# EAGLE design multiEncoder (EAGLE 9.6.2)
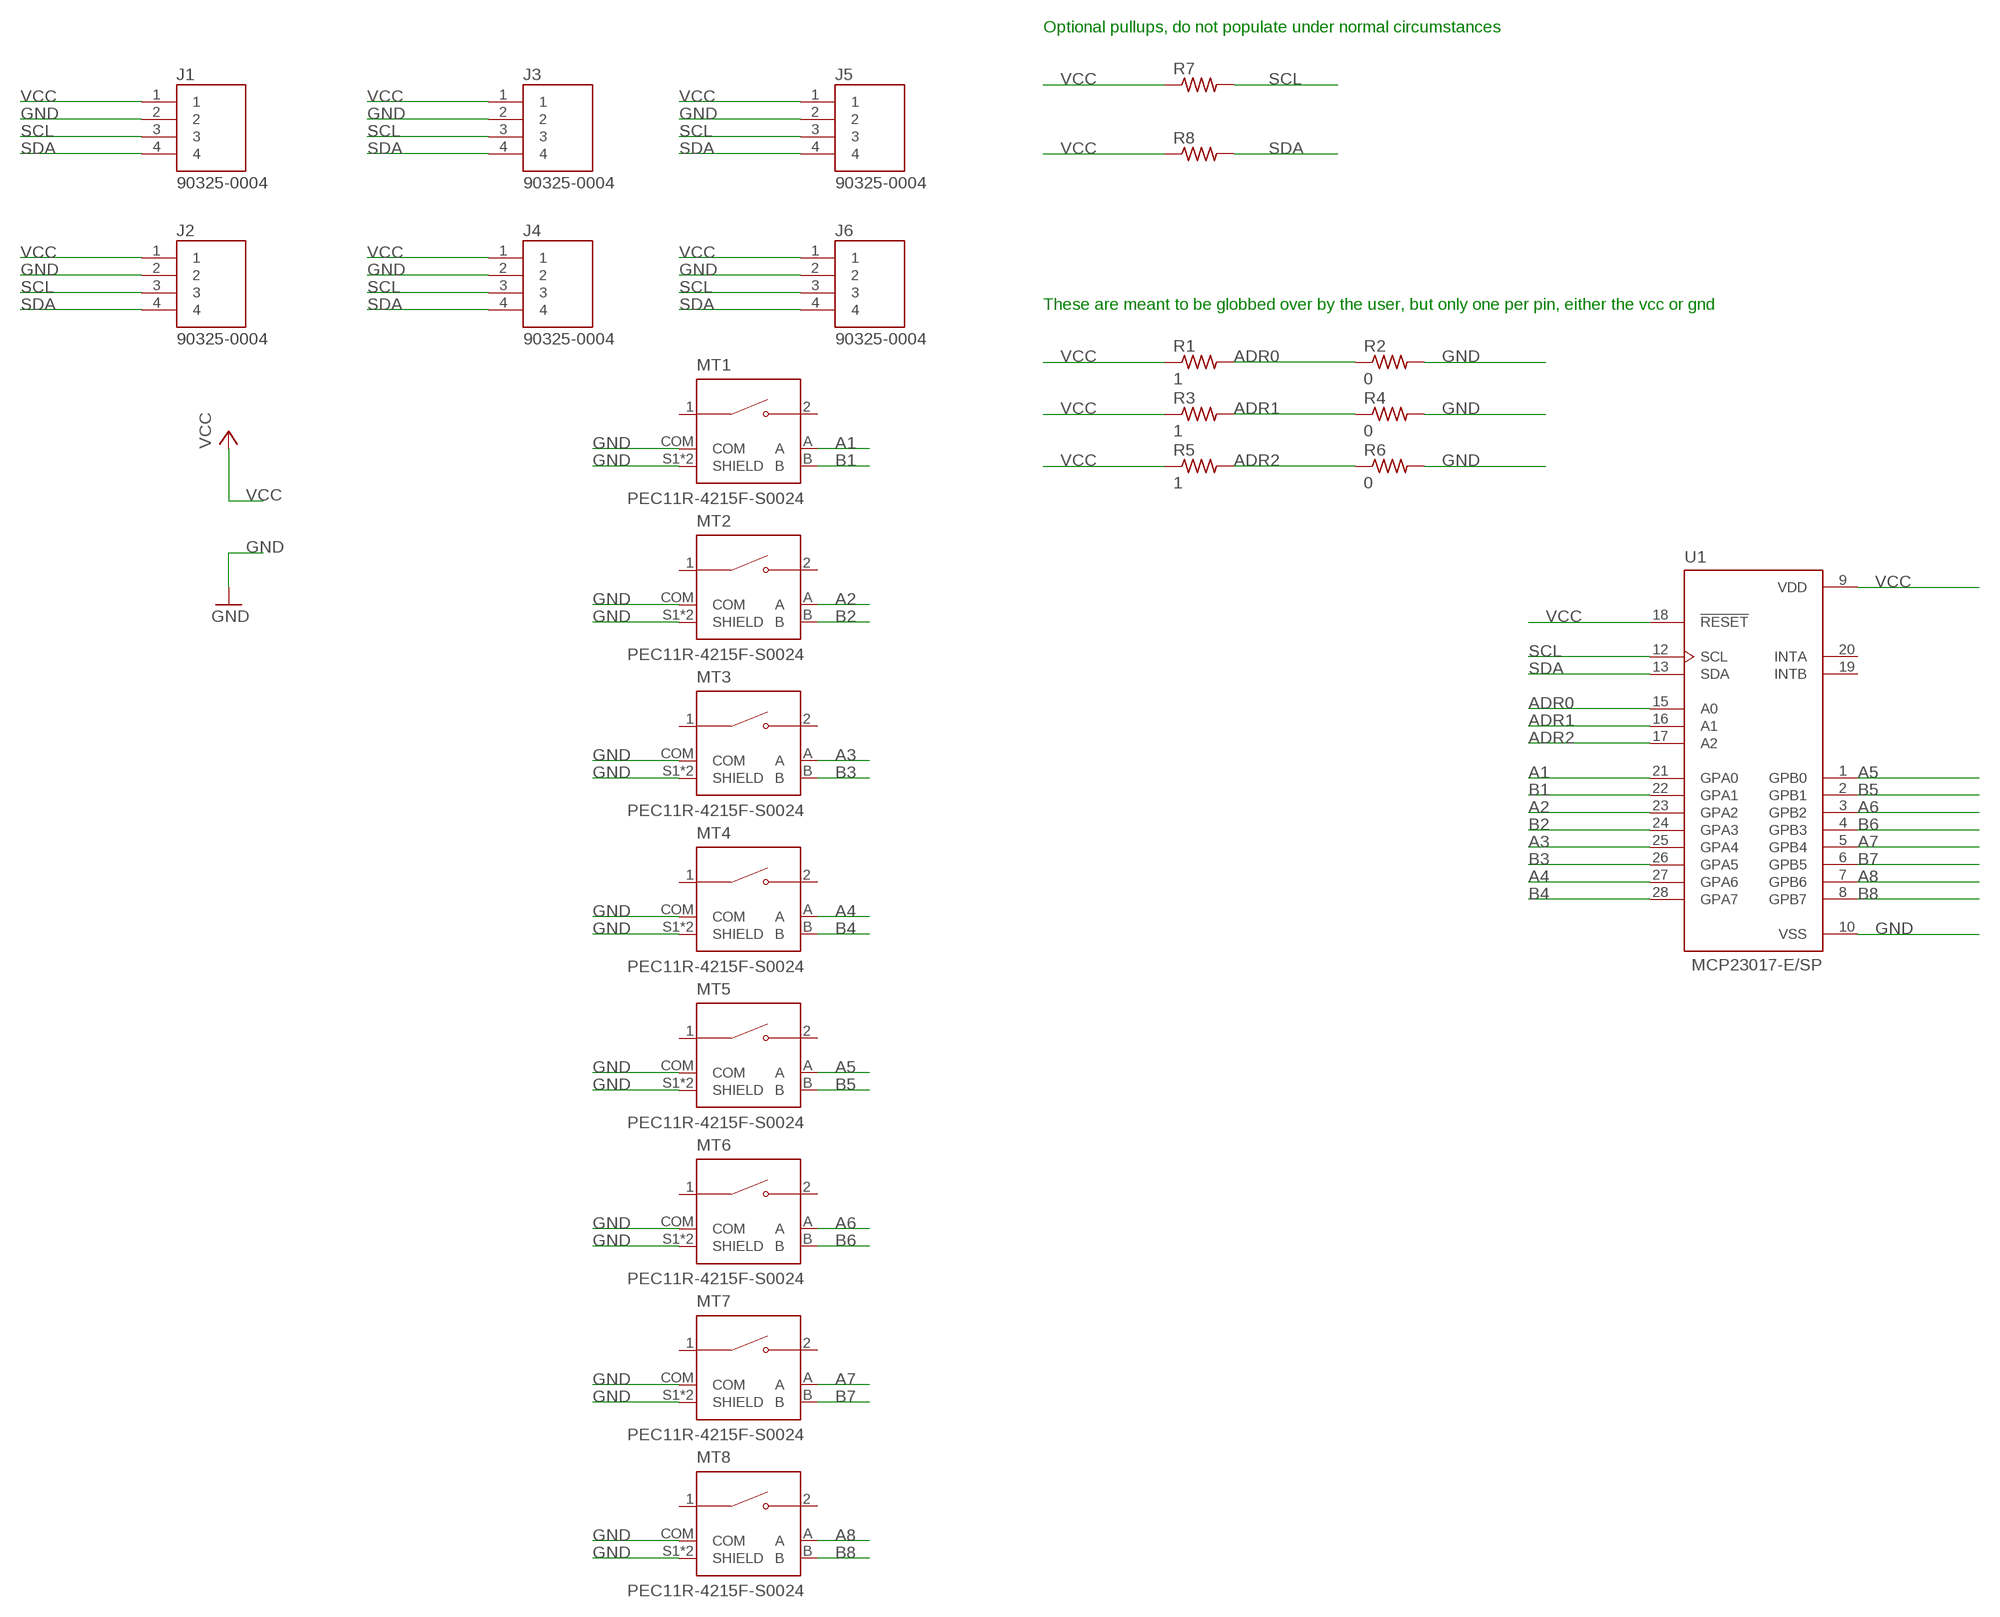
[diagram p0: schematic, sheet 1]

## Parts
J1  90325-0004  [MOLEX_90325-0004]
J2  90325-0004  [MOLEX_90325-0004]
J3  90325-0004  [MOLEX_90325-0004]
J4  90325-0004  [MOLEX_90325-0004]
J5  90325-0004  [MOLEX_90325-0004]
J6  90325-0004  [MOLEX_90325-0004]
MT1  PEC11R-4215F-S0024  [XDCR_PEC11R-4215F-S0024]
MT2  PEC11R-4215F-S0024  [XDCR_PEC11R-4215F-S0024]
MT3  PEC11R-4215F-S0024  [XDCR_PEC11R-4215F-S0024]
MT4  PEC11R-4215F-S0024  [XDCR_PEC11R-4215F-S0024]
MT5  PEC11R-4215F-S0024  [XDCR_PEC11R-4215F-S0024]
MT6  PEC11R-4215F-S0024  [XDCR_PEC11R-4215F-S0024]
MT7  PEC11R-4215F-S0024  [XDCR_PEC11R-4215F-S0024]
MT8  PEC11R-4215F-S0024  [XDCR_PEC11R-4215F-S0024]
R1  1  R-US_R0805  [R0805]
R2  0  R-US_R0805  [R0805]
R3  1  R-US_R0805  [R0805]
R4  0  R-US_R0805  [R0805]
R5  1  R-US_R0805  [R0805]
R6  0  R-US_R0805  [R0805]
R7  1K  R-US_R0805  [R0805]
R8  1K  R-US_R0805  [R0805]
U1  MCP23017-E/SP  [DIP787W45P254L3556H508Q28]

## Nets
A1: MT1.A U1.21(GPA0)
A2: MT2.A U1.23(GPA2)
A3: MT3.A U1.25(GPA4)
A4: MT4.A U1.27(GPA6)
A5: MT5.A U1.1(GPB0)
A6: MT6.A U1.3(GPB2)
A7: MT7.A U1.5(GPB4)
A8: MT8.A U1.7(GPB6)
ADR0: R1.2 R2.1 U1.15(A0)
ADR1: R3.2 R4.1 U1.16(A1)
ADR2: R5.2 R6.1 U1.17(A2)
B1: MT1.B U1.22(GPA1)
B2: MT2.B U1.24(GPA3)
B3: MT3.B U1.26(GPA5)
B4: MT4.B U1.28(GPA7)
B5: MT5.B U1.2(GPB1)
B6: MT6.B U1.4(GPB3)
B7: MT7.B U1.6(GPB5)
B8: MT8.B U1.8(GPB7)
GND: J1.2 J2.2 J3.2 J4.2 J5.2 J6.2 MT1.COM MT1.S1(SHIELD) MT1.S2(SHIELD) MT2.COM MT2.S1(SHIELD) MT2.S2(SHIELD) MT3.COM MT3.S1(SHIELD) MT3.S2(SHIELD) MT4.COM MT4.S1(SHIELD) MT4.S2(SHIELD) MT5.COM MT5.S1(SHIELD) MT5.S2(SHIELD) MT6.COM MT6.S1(SHIELD) MT6.S2(SHIELD) MT7.COM MT7.S1(SHIELD) MT7.S2(SHIELD) MT8.COM MT8.S1(SHIELD) MT8.S2(SHIELD) R2.2 R4.2 R6.2 U1.10(VSS)
SCL: J1.3 J2.3 J3.3 J4.3 J5.3 J6.3 R7.2 U1.12(SCL)
SDA: J1.4 J2.4 J3.4 J4.4 J5.4 J6.4 R8.2 U1.13(SDA)
VCC: J1.1 J2.1 J3.1 J4.1 J5.1 J6.1 R1.1 R3.1 R5.1 R7.1 R8.1 U1.9(VDD) U1.18(!RESET)
Unconnected: MT1.1 MT1.2 MT2.1 MT2.2 MT3.1 MT3.2 MT4.1 MT4.2 MT5.1 MT5.2 MT6.1 MT6.2 MT7.1 MT7.2 MT8.1 MT8.2 U1.19(INTB) U1.20(INTA)

## Notes on the sheet
- Optional pullups, do not populate under normal circumstances
- These are meant to be globbed over by the user, but only one per pin, either the vcc or gnd

## Library data of the parts
J1-J6 = 90325-0004:90325-0004: Connector Header Through Hole 4 position 0.050" (1.27mm) Check prices <https://pricing.snapeda.com/parts/90325-0004/Molex/view-part?ref=eda>; AVAILABILITY: In Stock; DESCRIPTION: HEADER, PICOFLEX, 4WAY; Connector Type:Wire-to-Board; Gender:Pin; Ways, No. of:4; Lead Spacing:1.27mm; Termination Method:Solder; Contact Material:Brass; Series:PICOFLEX PF50; Contact Plating:Tin; Rows, No. of:1; Colour:Black; Current Rating:1.2A; Flammability Rating:UL94V-0; Material:Polyester; No. of Poles:4; Pitch:1.27mm; Resistance, Contact:10mohm; Temp, Op. Max:105°C; Temp, Op. Min:-25°C; Voltage Rating, AC:250V; Voltage, Withstand:750V; Voltage, Working:250V; Width, External:3.81mm; Wire Size, AWG Max:26AWG; Wire Size, AWG Min:28AWG; Fixing Centres:7.41mm; MF: Molex; MP: 90325-0004; PACKAGE: None; PRICE: None; PURCHASE-URL: https://pricing.snapeda.com/search/part/90325-0004/?ref=eda
MT1-MT8 = PEC11R-4215F-S0024:PEC11R-4215F-S0024: Incremental Encoder, 12 Mm, Contact Rating 10 Ma - 5 Vdc Check prices <https://pricing.snapeda.com/parts/PEC11R-4215F-S0024/Bourns/view-part?ref=eda>; AVAILABILITY: In Stock; DESCRIPTION: Rotary Encoder Mechanical 24 Quadrature (Incremental) Vertical; MF: Bourns; MP: PEC11R-4215F-S0024; PACKAGE: None; PRICE: None; PURCHASE-URL: https://pricing.snapeda.com/search/part/PEC11R-4215F-S0024/?ref=eda
R1-R8 = rcl:R-US_: RESISTOR, American symbol; SPICEPREFIX: R
U1 = MCP23017-E_SP:MCP23017-E/SP: MCP23017 Series 5.5 V 1.7 MHz SMT 16-Bit I2C I/O Expander - SPDIP-28 Check prices <https://pricing.snapeda.com/parts/MCP23017-E/SP/Microchip/view-part?ref=eda>; AVAILABILITY: In Stock; DESCRIPTION: I/O Expander 16 I²C 1.7MHz 28-SPDIP; MF: Microchip; MP: MCP23017-E/SP; PACKAGE: DIP-28 Microchip; PRICE: None; PURCHASE-URL: https://pricing.snapeda.com/search/part/MCP23017-E/SP/?ref=eda

## Board
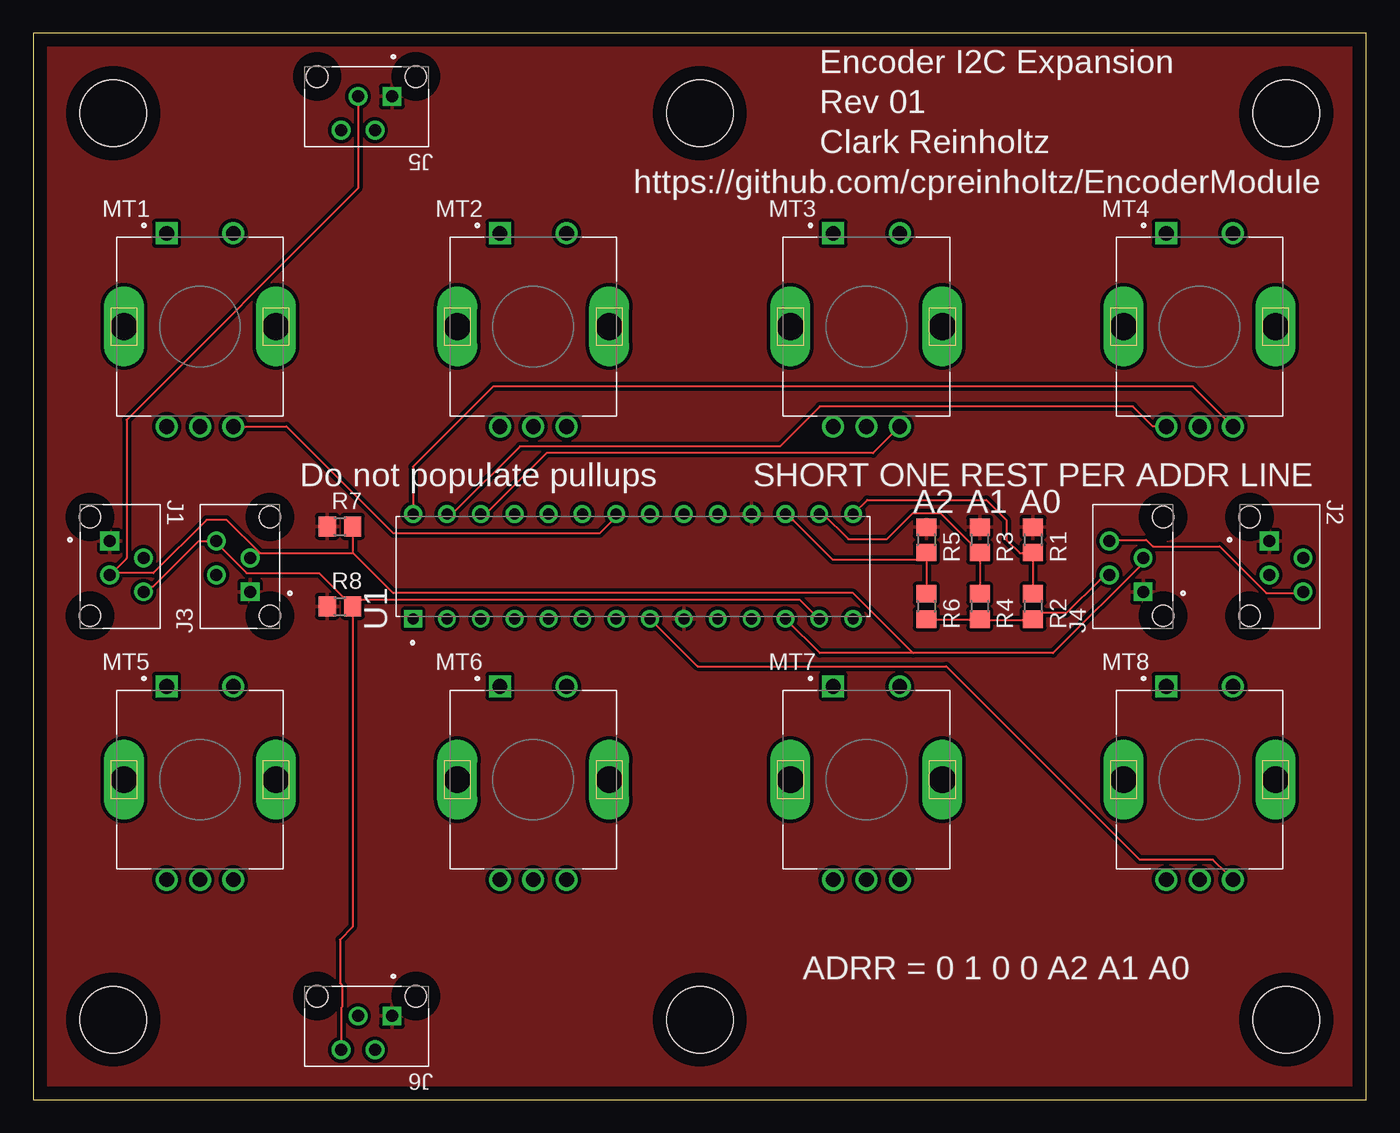
[diagram p1: board, top side]
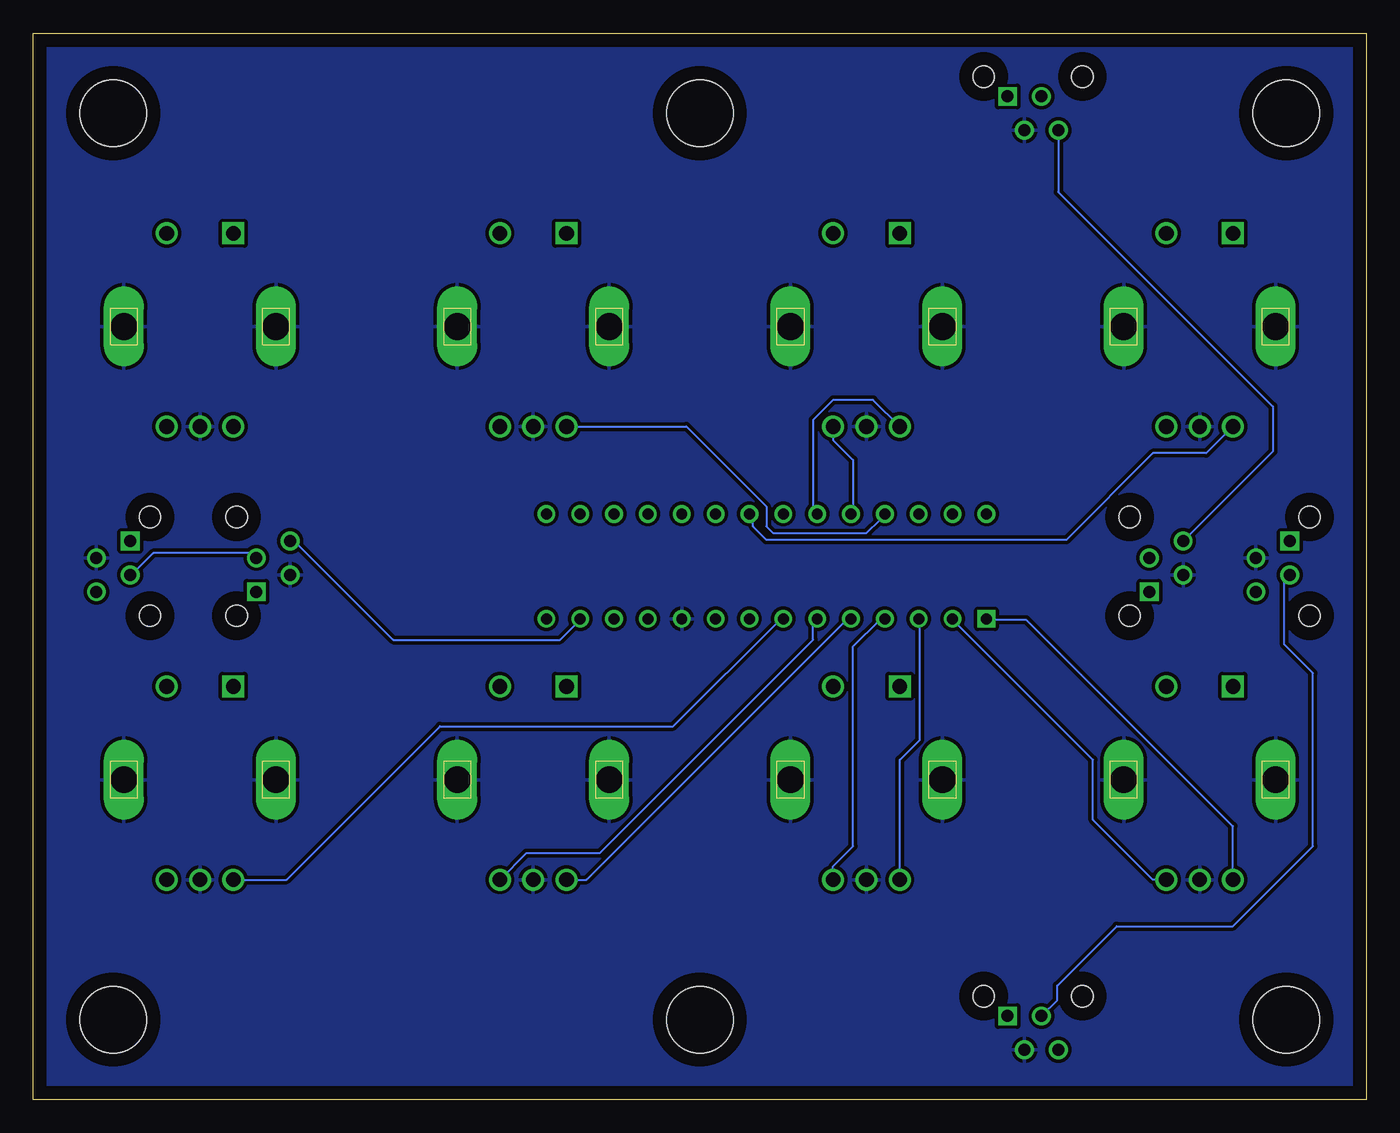
[diagram p2: board, bottom side, seen from below]

Size 100 x 80 mm. Coordinates in mm from the lower left corner, seen from the top.
Outline: 0,0 100,0 100,80 0,80 0,0
Copper layers (1*16): Top 0.035mm / dielectric 1.5mm / Bottom 0.035mm
Design rules "default *": minimum track width 6mil, minimum drill 0.35mm, track to track 10mil, track to pad 6mil, pad to pad 6mil, via to via 6mil, smd to smd 6mil, copper to edge 40mil, drill to drill 6mil, minimum pad ring 10mil, minimum via ring 8mil, stop-mask expansion 4mil, vias tented up to drill 0mil, thermal gap 10mil
Holes 5 mm at 6,6 94,6 6,74 94,74 50,74 50,6

### Footprints (pad centres in the part's own frame; a part is rotated, then mirrored left to right if it is on the bottom)
MOLEX_90325-0004 = drill 0.9 square: 1 -1.905,-1.27 | drill 0.9: 2 -0.635,1.27; 3 0.635,-1.27; 4 1.905,1.27 | hole 1.6: 3.705,-2.75; -3.705,-2.75
XDCR_PEC11R-4215F-S0024 = drill 1.1 square: 1 -2.5,7 | drill 1.1: 2 2.5,7; A -2.5,-7.5; B 2.5,-7.5; COM 0,-7.5 | drill 2 long: S1 -5.7,0; S2 5.7,0
R0805 = smd 1.3 x 1.5: 1 -0.95,0; 2 0.95,0
DIP787W45P254L3556H508Q28 = drill 0.82 pad 1.23 square: 1 -3.935,16.51 | drill 0.82 pad 1.23: 2 -3.935,13.97; 3 -3.935,11.43; 4 -3.935,8.89; 5 -3.935,6.35; 6 -3.935,3.81; 7 -3.935,1.27; 8 -3.935,-1.27; 9 -3.935,-3.81; 10 -3.935,-6.35; 11 -3.935,-8.89; 12 -3.935,-11.43; 13 -3.935,-13.97; 14 -3.935,-16.51; 15 3.935,-16.51; 16 3.935,-13.97; 17 3.935,-11.43; 18 3.935,-8.89; 19 3.935,-6.35; 20 3.935,-3.81; 21 3.935,-1.27; 22 3.935,1.27; 23 3.935,3.81; 24 3.935,6.35; 25 3.935,8.89; 26 3.935,11.43; 27 3.935,13.97; 28 3.935,16.51

### Placement (x,y rotation side)
J1  7,40 270 top
J2  94,40 270 top
J3  15,40 90 top
J4  82,40 90 top
J5  25,74 180 top
J6  25,5 180 top
MT1  12.5,58 0 top
MT2  37.5,58 0 top
MT3  62.5,58 0 top
MT4  87.5,58 0 top
MT5  12.5,24 0 top
MT6  37.5,24 0 top
MT7  62.5,24 0 top
MT8  87.5,24 0 top
R1  75,42 270 top
R2  75,37 270 top
R3  71,42 270 top
R4  71,37 270 top
R5  67,42 270 top
R6  67,37 270 top
R7  23,43 0 top
R8  23,37 0 top
U1  45,40 90 top

### Tracks (layer width: path | path; a pad name or v marks a point on that pad's centre or on a via)
A1
  Bottom 0.152: MT1.A 12,48.5 16,48.5 22.5,42 45,42 46,43 46,43.5 U1.21
A2
  Bottom 0.152: MT2.A 37,52.5 40,52.5 41.5,51 41.5,44 U1.23
A3
  Bottom 0.152: MT3.A 51,50.5 45,44.5 45,43 44.5,42.5 37.5,42.5 36.5,43.5 U1.25
A4
  Top 0.152: MT4.A 84,50.5 82.5,52 59,52 56,49 36.5,49 31.5,44 U1.27
A5
  Bottom 0.152: MT5.A 10,20.5 25.5,36 28,36 U1.1
A6
  Bottom 0.152: MT6.A 35,25.5 33.5,27 33.5,36 U1.3
A7
  Bottom 0.152: MT7.A 58.5,16.5 39,36 U1.5
A8
  Bottom 0.152: MT8.A 81,16.5 69.5,28 52,28 44,36 U1.7
ADR0
  Top 0.152: U1.15 62.58,45 71.5,45 73,43.5 73,42 74,41 75,41 | R1.2 75,41 | 75,41 R2.1
ADR1
  Top 0.152: U1.16 59.25,43.94 61.14,42.04 64.04,42.04 66,44 68.05,44 R3.2 R4.1
ADR2
  Top 0.152: R6.1 R5.2 66.45,40.5 60,40.5 57,43.5 56.5,43.5 U1.17
B1
  Top 0.152: MT1.B 19,50.5 27,42.5 42.5,42.5 43.5,43.5 U1.22
B2
  Bottom 0.152: MT2.B 40,49.5 38.5,48 38.5,44 U1.24
B3
  Top 0.152: MT3.B 64.5,50.5 64.5,50 63,48.5 38.5,48.5 34,44 U1.26
B4
  Top 0.152: MT4.B 89.5,50.5 89.5,51 87,53.5 34.5,53.5 28.49,47.49 U1.28
B5
  Bottom 0.152: MT5.B 16,16.5 20.5,21 20.5,25.5 31,36 U1.2
B6
  Bottom 0.152: MT6.B 40,17.5 38.5,19 38.5,34 36.5,36 U1.4
B7
  Bottom 0.152: MT7.B 63,18.5 57.5,18.5 41.5,34.5 41.5,36 U1.6
B8
  Top 0.152: MT8.B 89.5,16.5 89.5,17 88.5,18 83,18 68.5,32.5 49.84,32.5 U1.8
GND
  Top 0.152: 71,36 67,36 R6.2 | 71,36 75,36 R2.2 75,36.5 77.5,36.5 80,39 80.5,39 J4.2 | 71,36 R4.2
  pour Bottom: 101,0 101,81 0,81 0,0 3,0 5,0
SCL
  Top 0.152: 24,41 24,43 R7.2 | 17,41 16.5,41 J3.3 | 17,41 24,41 | 17,41 14.5,43.5 13,43.5 9,39.5 6,39.5 5.8,39.4 | 5.8,39.4 J1.3 | 66,33.5 76.5,33.5 83.5,40.5 J4.3 | 66,33.5 59,33.5 56.5,36 U1.12 | 24,41 27,38 61.5,38 66,33.5 | J5.3 24.36,68.36 7,51 7,40.6 5.8,39.4
  Bottom 0.152: J2.3 92.5,39.5 91,41 83.5,41 J4.3 | J6.3 23.19,7.45 23.19,8.53 18.72,13 10,13 4,19 4,32 6.14,34.14 6.14,38.95 J1.3
SDA
  Top 0.152: 24,37.5 24,37 R8.2 | J1.4 8.5,38.5 9,38.5 12.4,41.91 J3.4 14,41.5 16,39.5 21.45,39.5 R8.2 | J2.4 95,38 92.5,38 89,41.5 84,41.5 83.5,42 81,42 J4.4 | 24,37.5 57.5,37.5 58.5,36.5 U1.13 | 24,37.5 R8.2 | R8.2 23.95,12.95 23,12 23,8.72 23.19,8.53 23.19,6.97 23.09,6.87 J6.4
  Bottom 0.152: U1.13 59,36 60.5,34.5 73,34.5 80.5,42 J4.4 | J5.4 23.09,68.09 7,52 7,48.63 J3.4
VCC
  pour Top: 0,83 0,0 102,0 102,84 0,84

### Text on the board
tPlace: Encoder I2C Expansion | Rev 01 | Clark Reinholtz | https://github.com/cpreinholtz/EncoderModule | Do not populate pullups | SHORT ONE REST PER ADDR LINE | A2 | A1 | A0 | ADRR = 0 1 0 0 A2 A1 A0